# Altium schematic sheet Regulator.SchDoc
size Letter; PageSetup: Record=PageOptions|CenterHorizontal=True|CenterVertical=True|PrintScale=0.42|XCorrection=1.00|YCorrection=1.00|PrintKind=1|BorderSize=5000000|LeftOffset=0|BottomOffset=0|Orientation=2|PaperLength=1000|PaperWidth=1000|Scale=100|PaperSource=7|PrintQuality=-4|MediaType=1|DitherType=10|PaperKind=A6|PrintScaleMode=1
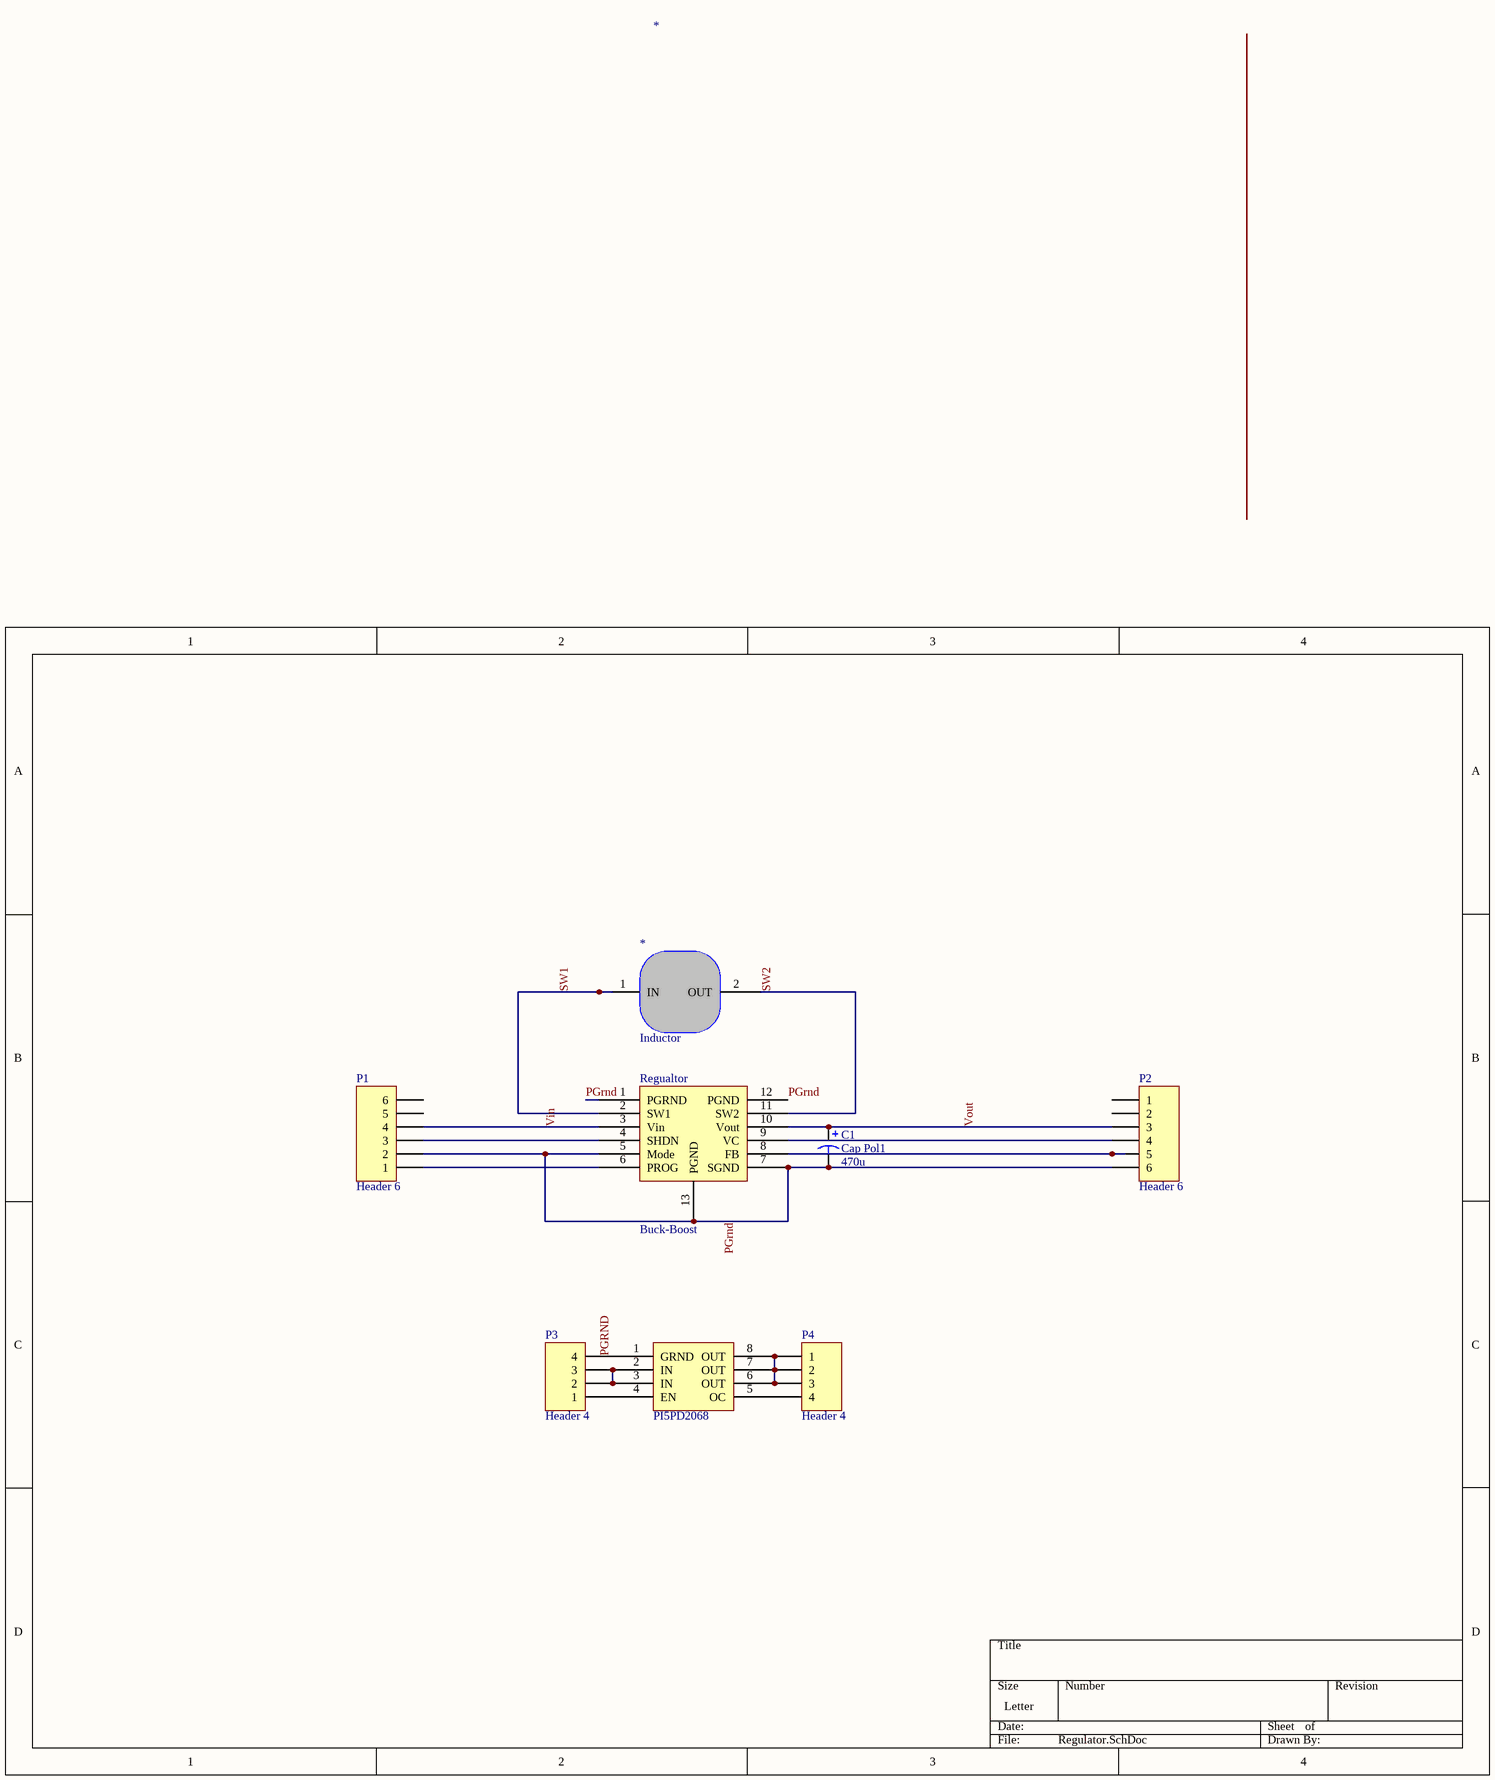
[diagram p0: Regulator.SchDoc]

## Parts
(Parts that share a designator on the sheet are numbered #1, #2 ... from top to bottom, then left to right.)
*#1  Inductor  [Inductor]
*#2  PI5PD2068  [SOP8 - duplicate]
C1  Cap Pol1  value 470u  [RB7.6-15]
P1  Header 6  [HDR1X6]
P2  Header 6  [HDR1X6]
P3  Header 4  [HDR1X4]
P4  Header 4  [HDR1X4]
Regualtor  Buck-Boost  [MSOP12W - duplicate]

## Nets
PGrnd: *#2.1(GRND) C1.2 P1.2 P2.6 P3.4 Regualtor.1(PGRND) Regualtor.5(Mode) Regualtor.7(SGND) Regualtor.12(PGND) Regualtor.13(PGND)
SW1: *#1.1(IN) Regualtor.2(SW1)
SW2: *#1.2(OUT) Regualtor.11(SW2)
Vin: P1.4 Regualtor.3(Vin)
Vout: C1.1 P2.3 Regualtor.10(Vout)
Net*#2_2: *#2.2(IN) *#2.3(IN) P3.2 P3.3
Net*#2_4: *#2.4(EN) P3.1
Net*#2_5: *#2.5(OC) P4.4
Net*#2_6: *#2.6(OUT) *#2.7(OUT) *#2.8(OUT) P4.1 P4.2 P4.3
NetP1_1: P1.1 Regualtor.6(PROG)
NetP1_3: P1.3 Regualtor.4(SHDN)
NetP2_4: P2.4 Regualtor.9(VC)
NetP2_5: P2.5 Regualtor.8(FB)

Not connected (* = marked no-connect by the designer): P1 5 6; P2 1 2

## Library data of the parts
C1 = Cap Pol1: Polarized Capacitor (Radial); Published: 8-Jun-2000; LatestRevisionDate: 17-Jul-2002; LatestRevisionNote: Re-released for DXP Platform.; PackageReference: RB7.6-15; Publisher: Altium Limited; PackageDescription: Polarized Capacitor (Radial); 2 Leads
P1 P2 = Header 6: Header, 6-Pin; LatestRevisionDate: 17-Jul-2002; LatestRevisionNote: Re-released for DXP Platform.; Publisher: Altium Limited
P3 P4 = Header 4: Header, 4-Pin; LatestRevisionDate: 17-Jul-2002; LatestRevisionNote: Re-released for DXP Platform.; Publisher: Altium Limited
Regualtor = LTC3127